# Altium schematic sheet 28Pins Schematic.SchDoc: 28Pins (part 3 of 3)
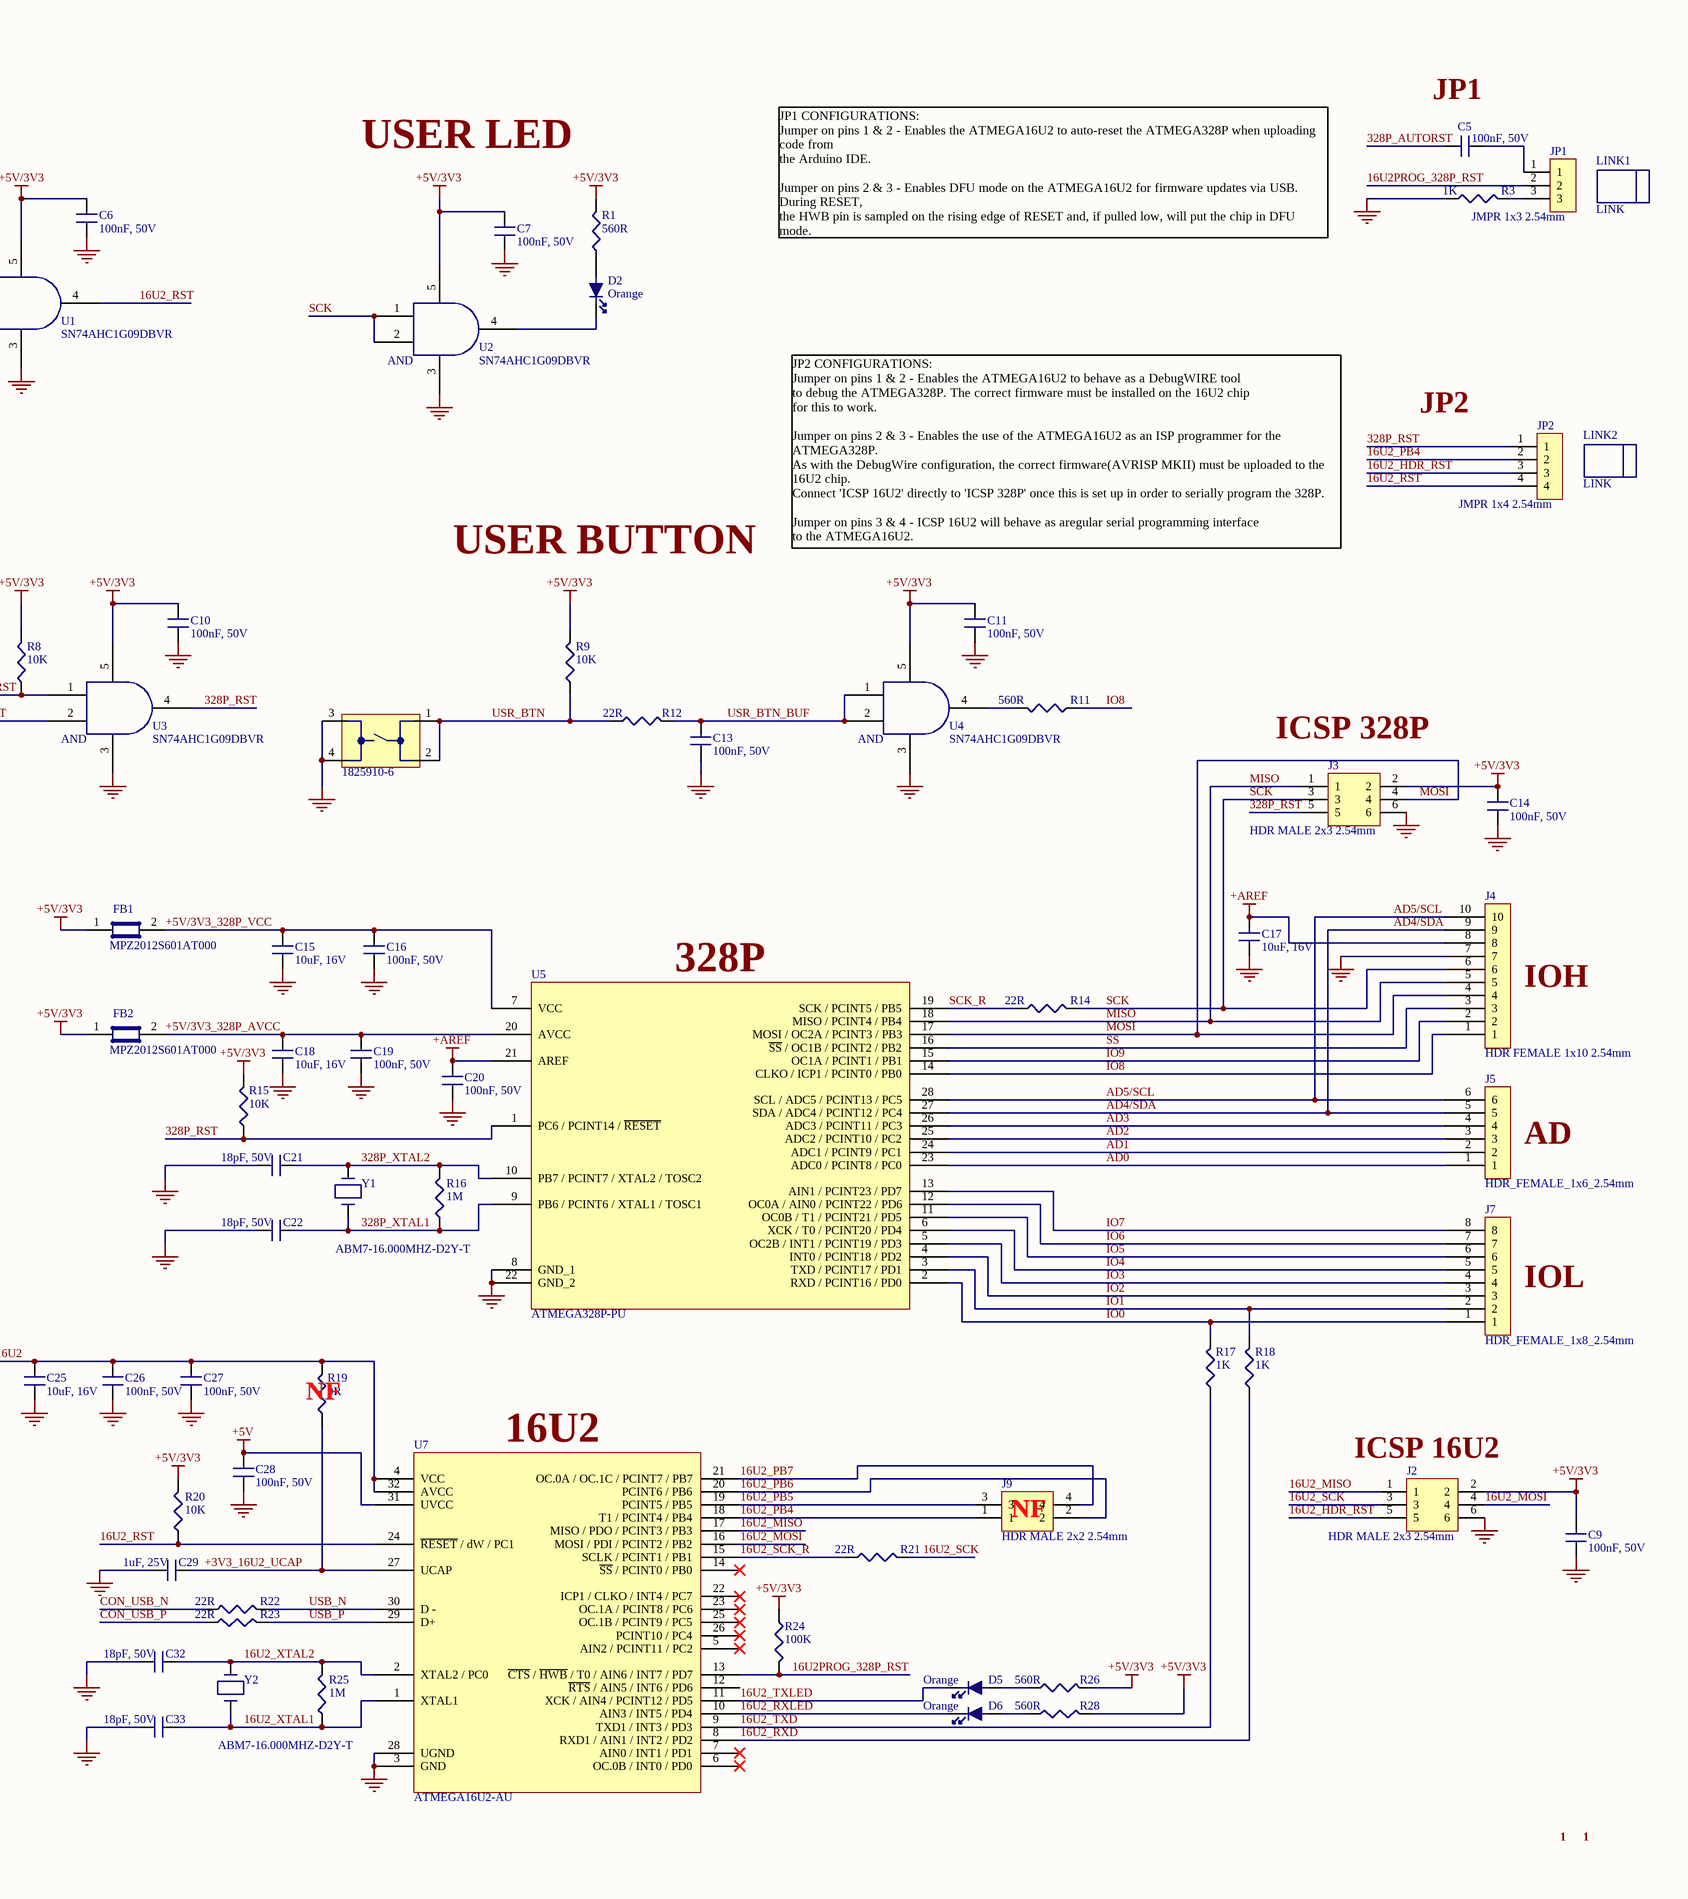
[diagram p3: 28Pins Schematic.SchDoc, right]

## Library data of the parts (continued)
Y1 Y2 = ABM7-16.000MHZ-D2Y-T: CRYSTAL 16.0000MHZ 18PF SMD; Manufacturer: Abracon; Catalog Drawings: ABM7 Series Top / ABM7 Series Side / ABM7 Series Bottom; Featured Product: ABM7 and ABM11 Crystals; 3D Model: ABM7.pdf / ABM7.stp; Frequency: 16MHz; Frequency Stability: ±30ppm; Frequency Tolerance: ±20ppm; ESR (Equivalent Series Resistance): 50 Ohm; Operating Mode: Fundamental; Online Catalog: ABM7 Series; Other Names: 535-9840-2 / ABM7-16.000MHZ-D-2-Y-T / ABM716000MHZD2YT; Supplier 1: Digi-Key; Manufacturer Part Number: ABM7-16.000MHZ-D2Y-T; Stock 1: 68132; Pricing 1: 1=1, 10=0.886, 50=0.8278, 100=0.7315, 500=0.693 (USD); RoHS Information: RoHS2/REACH Compliance; Standard Package: 1,000; Category: Crystals and Oscillators; Family: Crystals; Series: ABM7; Packaging: Tape & Reel (TR); Type: MHz Crystal; Load Capacitance: 18pF; Operating Temperature: -40°C ~ 85°C; Mounting Type: Surface Mount; Package / Case: 2-SMD; Size / Dimension: 0.236" L x 0.138" W (6.00mm x 3.50mm); Height: 0.055" (1.40mm); ComponentLink1URL: https://www.verical.com/server-webapp/html/getDatasheet?partID=721624&src-supplier=Verical; ComponentLink1Description: https://www.verical.com/server-webapp/html/getDatasheet?partID=721624&src-supplier=Verical; ComponentLink2URL: http://www.farnell.com/datasheets/947971.pdf?src-supplier=Element14; ComponentLink2Description: http://www.farnell.com/datasheets/947971.pdf?src-supplier=Element14; ComponentLink3URL: http://www.abracon.com/Resonators/abm7.pdf?src-supplier=Farnell; ComponentLink3Description: http://www.abracon.com/Resonators/abm7.pdf?src-supplier=Farnell; ComponentLink4URL: http://www.abracon.com/Resonators/abm7.pdf?src-supplier=Future+Electronics; ComponentLink4Description: http://www.abracon.com/Resonators/abm7.pdf?src-supplier=Future+Electronics; ComponentLink5URL: https://abracon.com/Resonators/abm7.pdf?src-supplier=Digi-Key; ComponentLink5Description: https://abracon.com/Resonators/abm7.pdf?src-supplier=Digi-Key; ComponentLink6URL: http://www.abracon.com/Support/PackageDrawing/Resonators/ABM7.PDF?src-supplier=Verical; ComponentLink6Description: http://www.abracon.com/Support/PackageDrawing/Resonators/ABM7.PDF?src-supplier=Verical; Supplier Part Number 1: 535-9840-1-ND
Z1 Z2 = CGA0603MLC-05E: ESD Suppressor TVS Bi-Dir 5V Automotive 2-Pin Case 0603(1608Metric) T/R; Manufacturer: Bourns; Clamping Voltage Vc Max: 30V; Diode Case Style: 0603; No. of Pins: 2Pins; Product Range: CGA06 Series; SVHC: No SVHC (17-Dec-2015); Supplier 1: Digi-Key; Manufacturer Part Number: CGA0603MLC-05E; Stock 1: 4653; Pricing 1: 1=0.44, 10=0.367, 25=0.3208, 100=0.275, 250=0.2384, 500=0.2017, 1000=0.1558, 2500=0.1421 (USD); Operating Voltage: 5V; Packaging: Cut Tape; ComponentLink1URL: http://www.mouser.com/ds/2/54/Bourns_CGA_MLC-280156.pdf?src-supplier=Mouser; ComponentLink1Description: http://www.mouser.com/ds/2/54/Bourns_CGA_MLC-280156.pdf?src-supplier=Mouser; ComponentLink2URL: http://www.farnell.com/datasheets/1772768.pdf?src-supplier=Element14; ComponentLink2Description: http://www.farnell.com/datasheets/1772768.pdf?src-supplier=Element14; ComponentLink3URL: http://www.bourns.com/data/global/pdfs/CGA-MLC.pdf?src-supplier=Avnet; ComponentLink3Description: http://www.bourns.com/data/global/pdfs/CGA-MLC.pdf?src-supplier=Avnet; Supplier Part Number 1: CGA0603MLC-05ECT-ND